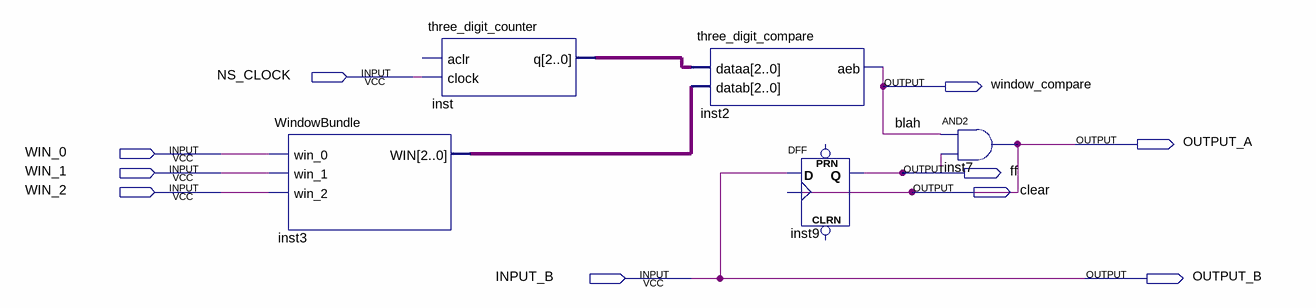
[diagram p0: schematic sheet]
// Quartus schematic delaySignal.bdf as structural Verilog: 5 symbols, 10 pins
module delaySignal (
  input  NS_CLOCK,
  input  WIN_0,
  input  WIN_1,
  input  WIN_2,
  input  INPUT_B,
  output window_compare,
  output OUTPUT_A,
  output ff,
  output clear,
  output OUTPUT_B
);

  wire [2:0] inst3_win, inst_q;

  WindowBundle inst3 (.win_0(WIN_0), .win_1(WIN_1), .win_2(WIN_2), .WIN(inst3_win));
  three_digit_counter inst (.clock(NS_CLOCK), .q(inst_q));  // open: aclr
  three_digit_compare inst2 (.dataa(inst_q), .datab(inst3_win), .aeb(window_compare));
  DFF inst9 (.CLK(clear), .D(INPUT_B), .Q(ff));  // open: CLRN, PRN
  and inst7 (clear, window_compare, ff);

  assign OUTPUT_A = clear;
  assign OUTPUT_B = INPUT_B;

  // Other names for the same wires on the sheet: blah = window_compare
endmodule
